# EAGLE design board-mostlaidout (EAGLE 9.5.2)
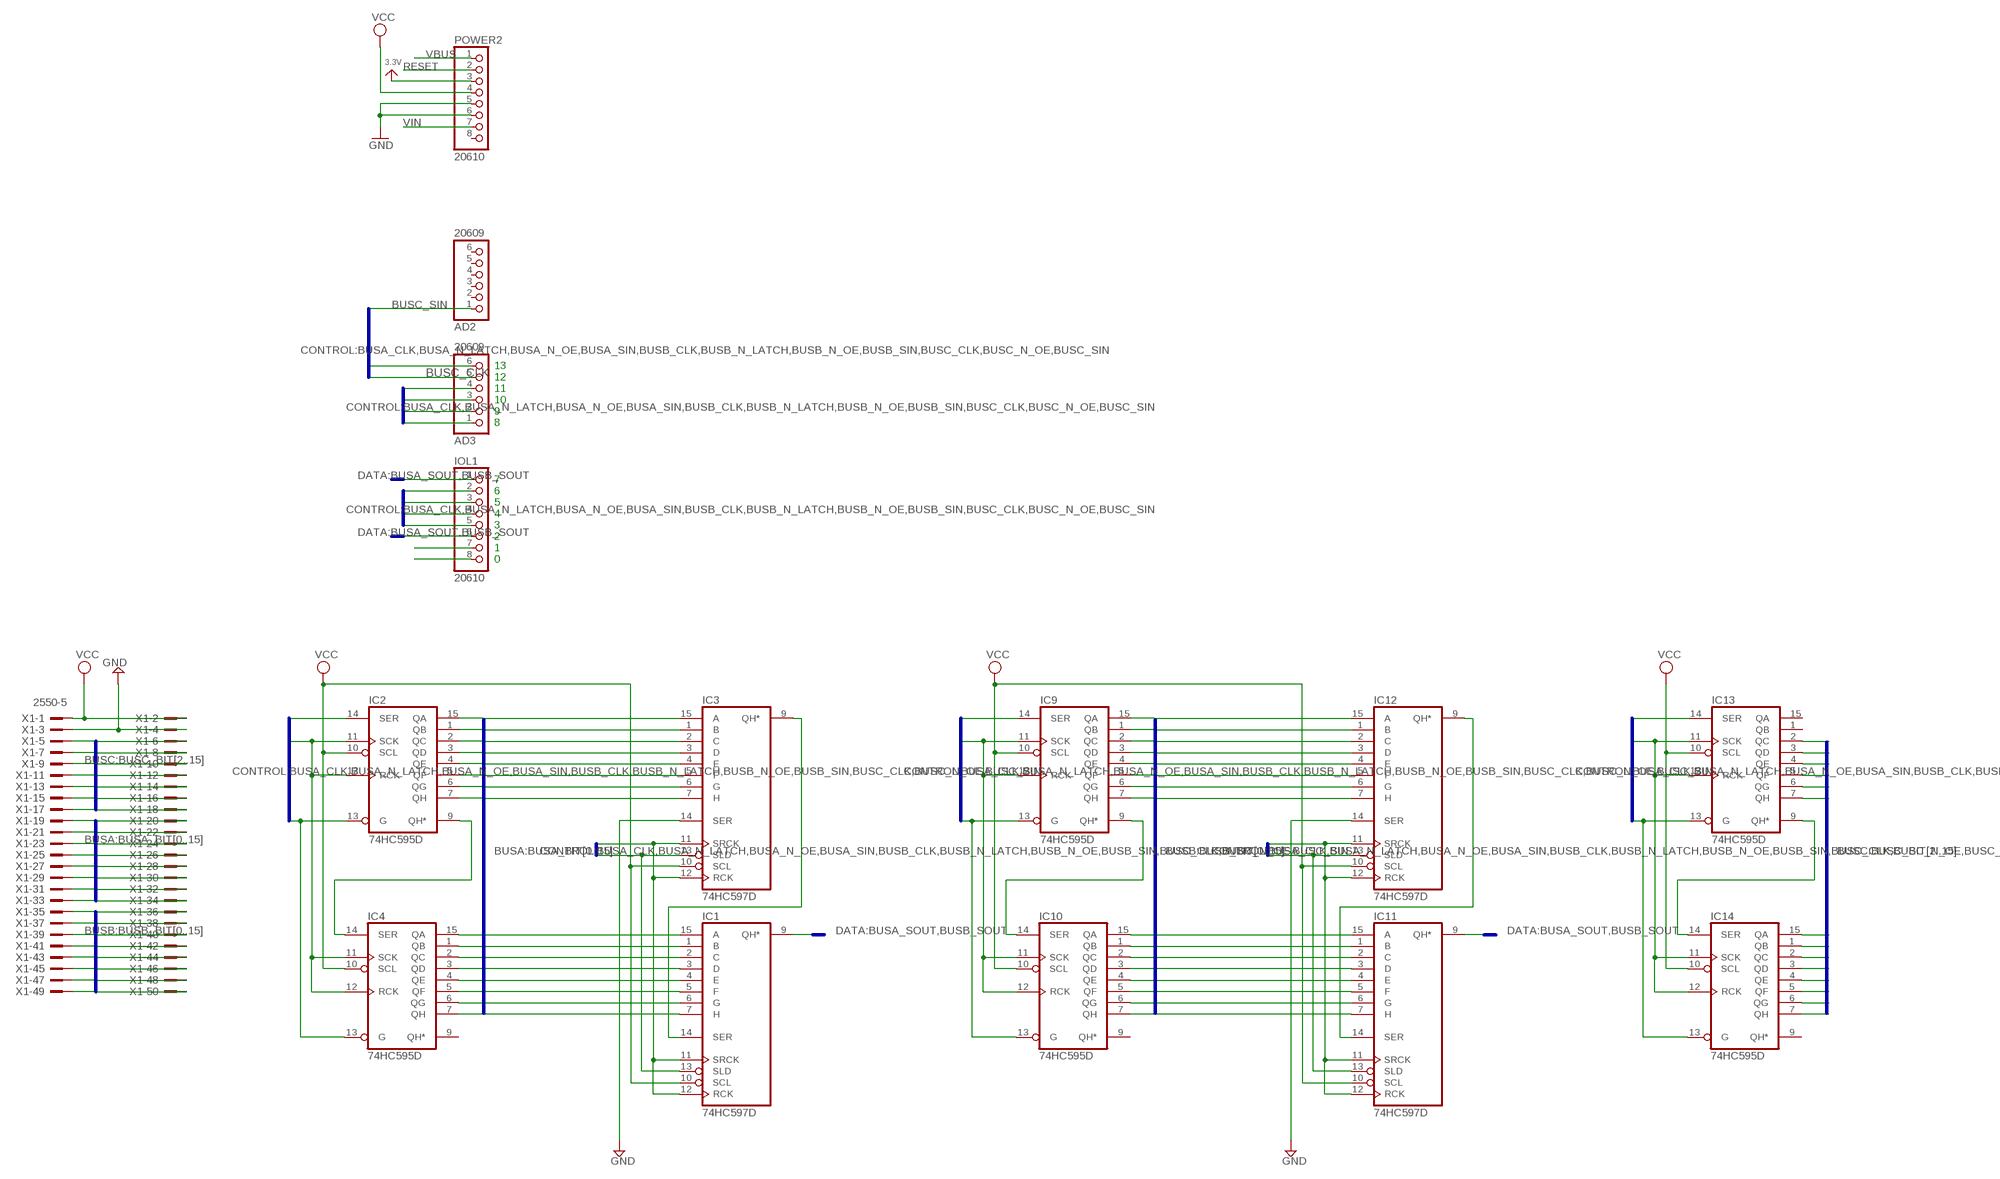
[diagram p0: schematic, sheet 1, part 1 of 2]
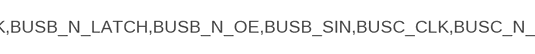
[diagram p1: schematic, sheet 1, part 2 of 2]

## Parts
AD2  20609  HEADER-1X6ROUND  [1X06_ROUND]
AD3  20609  HEADER-1X6ROUND  [1X06_ROUND]
IC1  74HC597D  [SO16]
IC2  74HC595D  [SO16]
IC3  74HC597D  [SO16]
IC4  74HC595D  [SO16]
IC9  74HC595D  [SO16]
IC10  74HC595D  [SO16]
IC11  74HC597D  [SO16]
IC12  74HC597D  [SO16]
IC13  74HC595D  [SO16]
IC14  74HC595D  [SO16]
IOL1  20610  HEADER-1X8ROUND  [1X08_ROUND]
POWER2  20610  HEADER-1X870MIL  [1X08_ROUND_70]
X1  2550-5  [PAK100/2500-5-50]

## Nets
3.3V: POWER2.3
BUSA_BIT0: IC2.15(QA) IC3.15(A) X1.19
BUSA_BIT1: IC2.1(QB) IC3.1(B) X1.20
BUSA_BIT2: IC2.2(QC) IC3.2(C) X1.21
BUSA_BIT3: IC2.3(QD) IC3.3(D) X1.22
BUSA_BIT4: IC2.4(QE) IC3.4(E) X1.23
BUSA_BIT5: IC2.5(QF) IC3.5(F) X1.24
BUSA_BIT6: IC2.6(QG) IC3.6(G) X1.25
BUSA_BIT7: IC2.7(QH) IC3.7(H) X1.26
BUSA_BIT8: IC1.15(A) IC4.15(QA) X1.27
BUSA_BIT9: IC1.1(B) IC4.1(QB) X1.28
BUSA_BIT10: IC1.2(C) IC4.2(QC) X1.29
BUSA_BIT11: IC1.3(D) IC4.3(QD) X1.30
BUSA_BIT12: IC1.4(E) IC4.4(QE) X1.31
BUSA_BIT13: IC1.5(F) IC4.5(QF) X1.32
BUSA_BIT14: IC1.6(G) IC4.6(QG) X1.33
BUSA_BIT15: IC1.7(H) IC4.7(QH) X1.34
BUSA_CLK: AD3.1 IC1.11(SRCK) IC1.12(RCK) IC2.11(SCK) IC2.12(RCK) IC3.11(SRCK) IC3.12(RCK) IC4.11(SCK) IC4.12(RCK)
BUSA_N_LATCH: AD3.2 IC1.13(SLD) IC3.13(SLD)
BUSA_N_OE: AD3.3 IC2.13(G) IC4.13(G)
BUSA_SIN: AD3.4 IC2.14(SER)
BUSA_SOUT: IC1.9(QH*) IOL1.1
BUSB_BIT0: IC9.15(QA) IC12.15(A) X1.35
BUSB_BIT1: IC9.1(QB) IC12.1(B) X1.36
BUSB_BIT2: IC9.2(QC) IC12.2(C) X1.37
BUSB_BIT3: IC9.3(QD) IC12.3(D) X1.38
BUSB_BIT4: IC9.4(QE) IC12.4(E) X1.39
BUSB_BIT5: IC9.5(QF) IC12.5(F) X1.40
BUSB_BIT6: IC9.6(QG) IC12.6(G) X1.41
BUSB_BIT7: IC9.7(QH) IC12.7(H) X1.42
BUSB_BIT8: IC10.15(QA) IC11.15(A) X1.43
BUSB_BIT9: IC10.1(QB) IC11.1(B) X1.44
BUSB_BIT10: IC10.2(QC) IC11.2(C) X1.45
BUSB_BIT11: IC10.3(QD) IC11.3(D) X1.46
BUSB_BIT12: IC10.4(QE) IC11.4(E) X1.47
BUSB_BIT13: IC10.5(QF) IC11.5(F) X1.48
BUSB_BIT14: IC10.6(QG) IC11.6(G) X1.49
BUSB_BIT15: IC10.7(QH) IC11.7(H) X1.50
BUSB_CLK: IC9.11(SCK) IC9.12(RCK) IC10.11(SCK) IC10.12(RCK) IC11.11(SRCK) IC11.12(RCK) IC12.11(SRCK) IC12.12(RCK) IOL1.5
BUSB_N_LATCH: IC11.13(SLD) IC12.13(SLD) IOL1.4
BUSB_N_OE: IC9.13(G) IC10.13(G) IOL1.3
BUSB_SIN: IC9.14(SER) IOL1.2
BUSB_SOUT: IC11.9(QH*) IOL1.6
BUSC_BIT2: IC13.2(QC) X1.5
BUSC_BIT3: IC13.3(QD) X1.6
BUSC_BIT4: IC13.4(QE) X1.7
BUSC_BIT5: IC13.5(QF) X1.8
BUSC_BIT6: IC13.6(QG) X1.9
BUSC_BIT7: IC13.7(QH) X1.10
BUSC_BIT8: IC14.15(QA) X1.11
BUSC_BIT9: IC14.1(QB) X1.12
BUSC_BIT10: IC14.2(QC) X1.13
BUSC_BIT11: IC14.3(QD) X1.14
BUSC_BIT12: IC14.4(QE) X1.15
BUSC_BIT13: IC14.5(QF) X1.16
BUSC_BIT14: IC14.6(QG) X1.17
BUSC_BIT15: IC14.7(QH) X1.18
BUSC_CLK: AD3.5 IC13.11(SCK) IC13.12(RCK) IC14.11(SCK) IC14.12(RCK)
BUSC_N_OE: AD3.6 IC13.13(G) IC14.13(G)
BUSC_SIN: AD2.1 IC13.14(SER)
GND: IC3.14(SER) IC12.14(SER) POWER2.5 POWER2.6 X1.3 X1.4
N$1: IC2.9(QH*) IC4.14(SER)
N$2: IC1.14(SER) IC3.9(QH*)
N$5: IC9.9(QH*) IC10.14(SER)
N$6: IC11.14(SER) IC12.9(QH*)
N$7: IC13.9(QH*) IC14.14(SER)
RESET: POWER2.2
RXD1: IOL1.8
TXD1: IOL1.7
VBUS: POWER2.1
VCC: IC1.10(SCL) IC2.10(SCL) IC3.10(SCL) IC4.10(SCL) IC9.10(SCL) IC10.10(SCL) IC11.10(SCL) IC12.10(SCL) IC13.10(SCL) IC14.10(SCL) POWER2.4 X1.1 X1.2
VIN [power]: POWER2.7
Unconnected: AD2.2 AD2.3 AD2.4 AD2.5 AD2.6 IC4.9(QH*) IC10.9(QH*) IC13.1(QB) IC13.15(QA) IC14.9(QH*) POWER2.8

## Buses
BUSA:BUSA_BIT[0..15]
CONTROL:BUSA_CLK,BUSA_N_LATCH,BUSA_N_OE,BUSA_SIN,BUSB_CLK,BUSB_N_LATCH,BUSB_N_OE,BUSB_SIN,BUSC_CLK,BUSC_N_OE,BUSC_SIN
BUSB:BUSB_BIT[0..15]
DATA:BUSA_SOUT,BUSB_SOUT
BUSC:BUSC_BIT[2..15]

## Notes on the sheet
- 13
- 12
- 11
- 10
- 9
- 8
- 7
- 6
- 5
- 4
- 3
- 2
- 1
- 0

## Power pins joined to a net without a drawn wire
GND: IC1.8(GND) IC2.8(GND) IC3.8(GND) IC4.8(GND) IC9.8(GND) IC10.8(GND) IC11.8(GND) IC12.8(GND) IC13.8(GND) IC14.8(GND)
VCC: IC1.16(VCC) IC2.16(VCC) IC3.16(VCC) IC4.16(VCC) IC9.16(VCC) IC10.16(VCC) IC11.16(VCC) IC12.16(VCC) IC13.16(VCC) IC14.16(VCC)

## Library data of the parts
AD2 AD3 = microbuilder:HEADER-1X6: PIN HEADER
IC1 IC3 IC11 IC12 = 74xx-eu:74*597: 8-bit SHIFT REGISTER, input latch
IC2 IC4 IC9 IC10 IC13 IC14 = 74xx-eu:74*595: 8-bit SHIFT REGISTER, output latch
IOL1 POWER2 = microbuilder:HEADER-1X8: PIN HEADER
X1 = con-3m:2550-: 3M (TM) Pak 100 4-Wall Header Source: 3M; OC_FARNELL: 1788696; OC_NEWARK: unknown

## Net classes
1 power: width 0.305 mm, drill 0.483 mm, clearance 0.203 mm
2 gnd: width 0.305 mm, drill 0.483 mm, clearance 0.203 mm
3 usbvcc: width 0.305 mm, drill 0.483 mm, clearance 0.203 mm

## Board
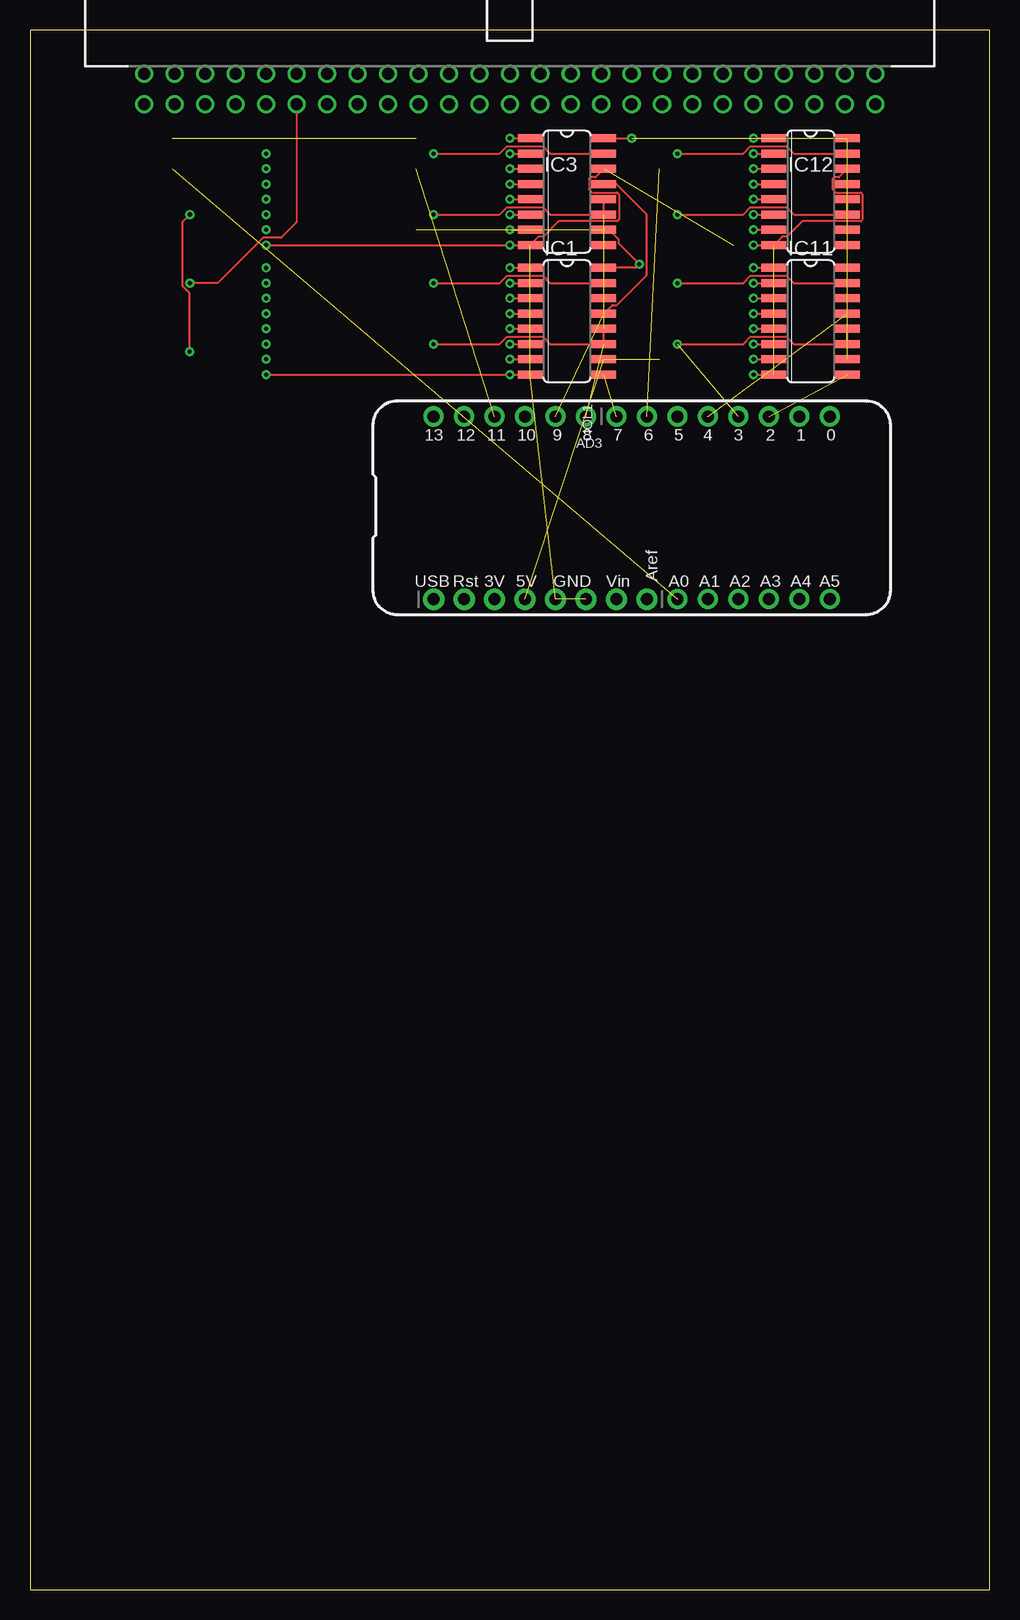
[diagram p2: board, top side]
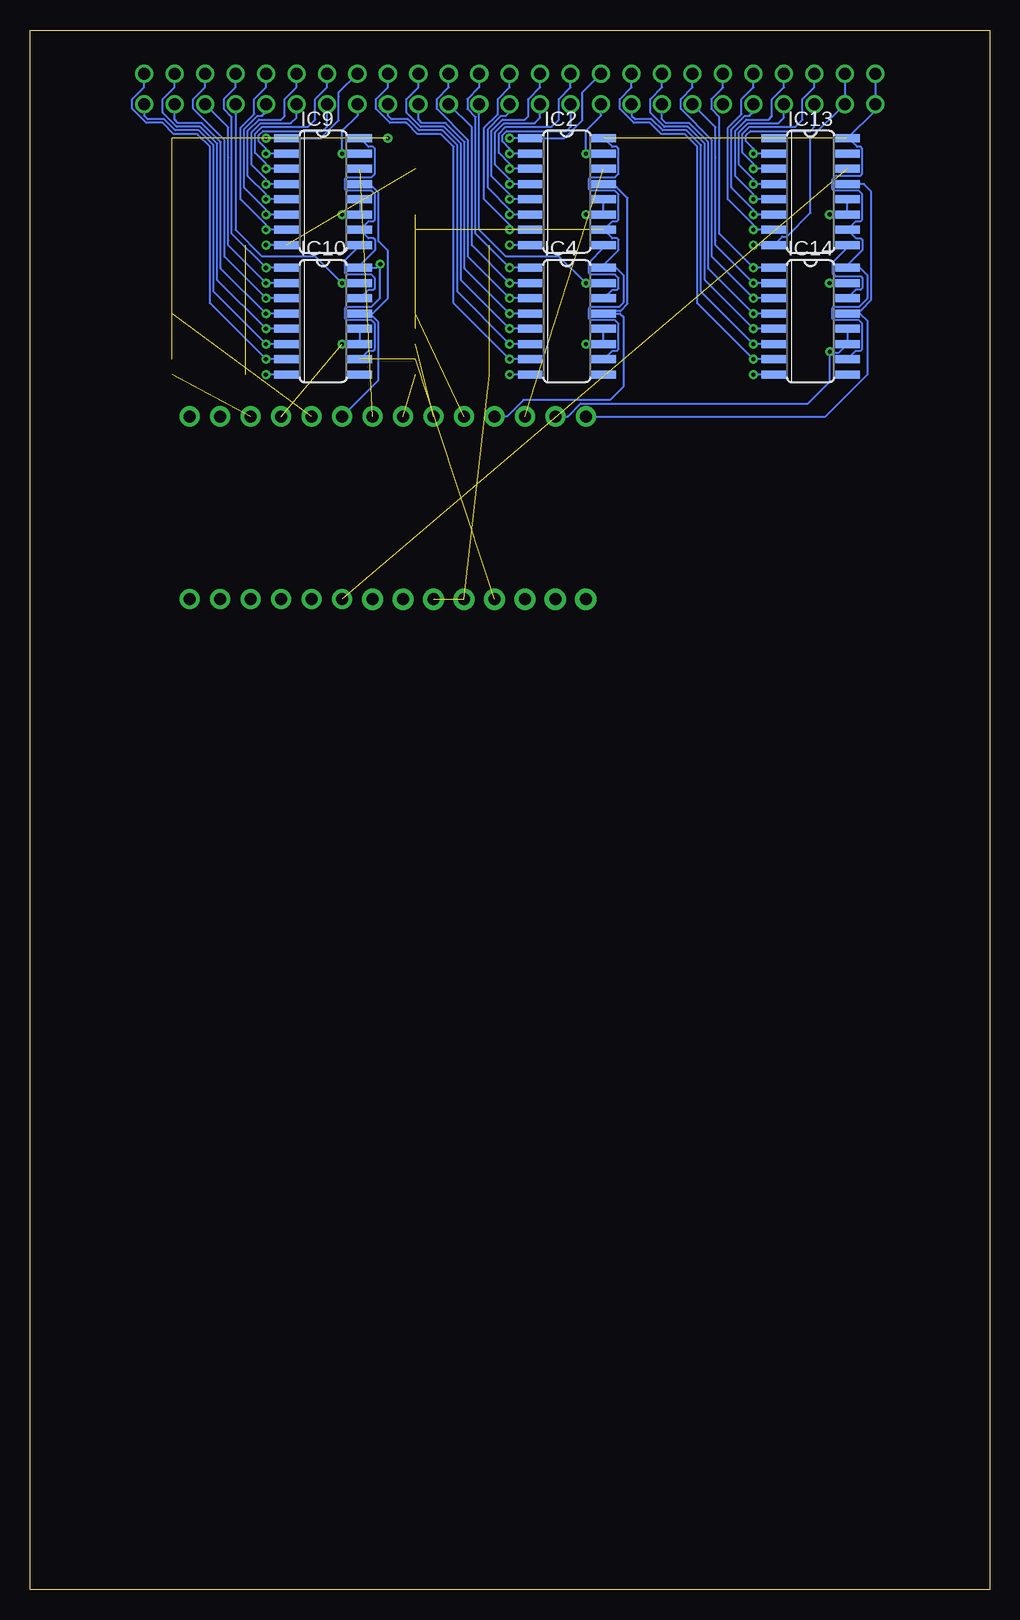
[diagram p3: board, bottom side, seen from below]

Size 80 x 130 mm. Coordinates in mm from the lower left corner, seen from the top.
Outline: 0,0 80,0 80,130 0,130 0,0
Copper layers (1*16): Top 0.035mm / dielectric 1.5mm / Bottom 0.035mm
Design rules "default": minimum track width 6mil, minimum drill 0.35mm, track to track 6mil, track to pad 6mil, pad to pad 6mil, via to via 6mil, smd to smd 6mil, copper to edge 40mil, drill to drill 6mil, minimum pad ring 10mil, minimum via ring 8mil, stop-mask expansion 4mil, vias tented up to drill 0mil, thermal gap 10mil

### Footprints (pad centres in the part's own frame; a part is rotated, then mirrored left to right if it is on the bottom)
1X06_ROUND = drill 1 pad 1.676: 1 -6.35,0; 2 -3.81,0; 3 -1.27,0; 4 1.27,0; 5 3.81,0; 6 6.35,0
SO16 = smd 0.66 x 2.032: 1 -4.445,-3.073; 2 -3.175,-3.073; 3 -1.905,-3.073; 4 -0.635,-3.073; 5 0.635,-3.073; 6 1.905,-3.073; 7 3.175,-3.073; 8 4.445,-3.073; 9 4.445,3.073; 10 3.175,3.073; 11 1.905,3.073; 12 0.635,3.073; 13 -0.635,3.073; 14 -1.905,3.073; 15 -3.175,3.073; 16 -4.445,3.073
1X08_ROUND = drill 1 pad 1.676: 1 -8.89,0; 2 -6.35,0; 3 -3.81,0; 4 -1.27,0; 5 1.27,0; 6 3.81,0; 7 6.35,0; 8 8.89,0
1X08_ROUND_70 = drill 1 pad 1.778: 1 -8.89,0; 2 -6.35,0; 3 -3.81,0; 4 -1.27,0; 5 1.27,0; 6 3.81,0; 7 6.35,0; 8 8.89,0
PAK100/2500-5-50 = drill 1 pad 1.422: 1 -30.48,-1.27; 2 -30.48,1.27; 3 -27.94,-1.27; 4 -27.94,1.27; 5 -25.4,-1.27; 6 -25.4,1.27; 7 -22.86,-1.27; 8 -22.86,1.27; 9 -20.32,-1.27; 10 -20.32,1.27; 11 -17.78,-1.27; 12 -17.78,1.27; 13 -15.24,-1.27; 14 -15.24,1.27; 15 -12.7,-1.27; 16 -12.7,1.27; 17 -10.16,-1.27; 18 -10.16,1.27; 19 -7.62,-1.27; 20 -7.62,1.27; 21 -5.08,-1.27; 22 -5.08,1.27; 23 -2.54,-1.27; 24 -2.54,1.27; 25 0,-1.27; 26 0,1.27; 27 2.54,-1.27; 28 2.54,1.27; 29 5.08,-1.27; 30 5.08,1.27; 31 7.62,-1.27; 32 7.62,1.27; 33 10.16,-1.27; 34 10.16,1.27; 35 12.7,-1.27; 36 12.7,1.27; 37 15.24,-1.27; 38 15.24,1.27; 39 17.78,-1.27; 40 17.78,1.27; 41 20.32,-1.27; 42 20.32,1.27; 43 22.86,-1.27; 44 22.86,1.27; 45 25.4,-1.27; 46 25.4,1.27; 47 27.94,-1.27; 48 27.94,1.27; 49 30.48,-1.27; 50 30.48,1.27

### Placement (x,y rotation side)
AD2  60.33,82.55 0 top
AD3  40.01,97.79 180 top
IC1  44.77,105.73 270 top
IC2  35.24,116.52 270 bottom
IC3  44.77,116.52 270 top
IC4  35.24,105.73 270 bottom
IC9  55.56,116.52 270 bottom
IC10  55.56,105.73 270 bottom
IC11  65.09,105.73 270 top
IC12  65.09,116.52 270 top
IC13  14.92,116.52 270 bottom
IC14  14.92,105.73 270 bottom
IOL1  57.78,97.79 0 top
POWER2  42.55,82.55 0 top
X1  40.01,125.09 0 top

### Tracks (layer width: path | path; a pad name or v marks a point on that pad's centre or on a via)
BUSA_BIT0  (via drill 0.35)  (1 unrouted)
  Top 0.152: v33.66,119.7 39.15,119.7 39.75,120.3 42.76,120.3 43.36,119.7 IC3.15
  Bottom 0.152: IC2.15 v33.66,119.7 33.66,121.6 32.38,122.87 X1.19
BUSA_BIT1  (via drill 0.35)
  Top 0.152: v40.01,120.97 IC3.1
  Bottom 0.152: v40.01,120.97 IC2.1 35.45,120.97 33.94,122.47 33.94,124.81 X1.20
BUSA_BIT2  (via drill 0.35)
  Top 0.152: v40.01,119.7 IC3.2
  Bottom 0.152: IC2.2 v40.01,119.7 40.01,120.11 40.61,120.72 40.61,121.22 40.26,121.57 35.27,121.57 34.92,121.92 X1.21
BUSA_BIT3  (via drill 0.35)
  Top 0.152: v40.01,118.43 IC3.3
  Bottom 0.152: IC2.3 v40.01,118.43 40.01,118.84 40.92,119.75 40.92,121.34 40.34,121.92 36.51,121.92 35.91,122.53 35.91,124.23 34.92,125.22 X1.22
BUSA_BIT4  (via drill 0.35)
  Top 0.152: v40.01,117.16 IC3.4
  Bottom 0.152: IC2.4 v40.01,117.16 40.01,117.57 41.22,118.79 41.22,121.47 40.47,122.22 37.94,122.22 37.47,122.69 X1.23
BUSA_BIT5  (via drill 0.35)
  Top 0.152: v40.01,115.89 IC3.5
  Bottom 0.152: IC2.5 v40.01,115.89 40.01,116.3 41.53,117.82 41.53,121.6 40.59,122.53 38.73,122.53 38.45,122.82 38.45,124.23 37.47,125.22 X1.24
BUSA_BIT6  (via drill 0.35)
  Top 0.152: v40.01,114.62 IC3.6
  Bottom 0.152: IC2.6 v40.01,114.62 40.01,115.03 41.83,116.86 41.83,121.72 40.72,122.83 40.32,122.83 40.01,123.15 X1.25
BUSA_BIT7  (via drill 0.35)
  Top 0.152: v40.01,113.35 IC3.7
  Bottom 0.152: IC2.7 v40.01,113.35 40.01,113.76 42.14,115.89 42.14,121.85 40.99,123 40.99,124.23 40.01,125.22 X1.26
BUSA_BIT8  (via drill 0.35)  (1 unrouted)
  Top 0.152: v33.66,108.9 39.15,108.9 39.75,109.51 42.76,109.51 43.36,108.9 IC1.15
  Bottom 0.152: IC4.15 v33.66,108.9 35.88,111.12 40.32,111.12 42.55,113.35 X1.27
BUSA_BIT9  (via drill 0.35)
  Top 0.152: v40.01,110.17 IC1.1
  Bottom 0.152: IC4.1 v40.01,110.17 42.85,113.02 42.85,122.74 43.53,123.42 43.53,124.23 42.55,125.22 X1.28
BUSA_BIT10  (via drill 0.35)
  Top 0.152: v40.01,108.9 IC1.2
  Bottom 0.152: IC4.2 v40.01,108.9 43.16,112.05 43.16,112.46 43.16,119.38 43.16,121.89 X1.29
BUSA_BIT11  (via drill 0.35)
  Top 0.152: v40.01,107.63 IC1.3
  Bottom 0.152: IC4.3 v40.01,107.63 43.46,111.09 43.46,120.81 46.07,123.42 46.07,124.23 45.09,125.22 X1.30
BUSA_BIT12  (via drill 0.35)
  Top 0.152: v40.01,106.36 IC1.4
  Bottom 0.152: IC4.4 v40.01,106.36 43.76,110.12 43.76,120.65 45.35,122.24 47.31,122.24 47.62,122.56 X1.31
BUSA_BIT13  (via drill 0.35)
  Top 0.152: v40.01,105.09 IC1.5
  Bottom 0.152: IC4.5 v40.01,105.09 44.07,109.16 44.07,120.52 45.48,121.93 47.43,121.93 48.61,123.11 48.61,124.23 47.62,125.22 X1.32
BUSA_BIT14  (via drill 0.35)
  Top 0.152: v40.01,103.82 IC1.6
  Bottom 0.152: IC4.6 v40.01,103.82 44.37,108.19 44.37,120.4 45.6,121.63 47.56,121.63 48.49,122.56 49.85,122.56 50.16,122.87 X1.33
BUSA_BIT15  (via drill 0.35)
  Top 0.152: v40.01,102.55 IC1.7
  Bottom 0.152: IC4.7 v40.01,102.55 44.68,107.23 44.68,120.27 45.73,121.32 47.69,121.32 48.61,122.25 49.98,122.25 51.15,123.42 51.15,124.23 50.16,125.22 X1.34
BUSA_CLK  (via drill 0.35)  (2 unrouted)
  Top 0.152: v33.66,114.62 39.15,114.62 39.75,115.22 42.76,115.22 43.36,114.62 IC3.11 IC3.12 | IC1.12 IC1.11 43.36,103.82 42.76,104.43 39.75,104.43 39.15,103.82 v33.66,103.82
  Bottom 0.152: v33.66,114.62 IC2.11 IC2.12 | IC4.12 IC4.11 v33.66,103.82
BUSA_N_LATCH  (1 unrouted)
  Top 0.152: IC1.13 48.55,107.07 48.95,107.07 51.44,109.56 51.44,114.62 48.9,117.16 IC3.13
BUSA_N_OE
  Bottom 0.152: AD3.3 40.24,97.79 38.87,99.16 31.65,99.16 30.48,100.33 30.48,106.05 30.8,106.36 IC4.13 | IC4.13 31.43,106.36 | IC4.13 31.91,106.62 30.75,106.62 30.18,107.19 30.18,115.99 31.09,116.9 31.91,116.9 IC2.13
BUSA_SIN  (1 unrouted)
BUSA_SOUT  (1 unrouted)
BUSB_BIT0  (via drill 0.35)  (1 unrouted)
  Top 0.152: v53.98,119.7 59.47,119.7 60.07,120.3 63.08,120.3 63.68,119.7 IC12.15
  Bottom 0.152: IC9.15 v53.98,119.7 53.98,121.6 52.7,122.87 X1.35
BUSB_BIT1  (via drill 0.35)
  Top 0.152: v60.33,120.97 IC12.1
  Bottom 0.152: v60.33,120.97 IC9.1 55.77,120.97 54.26,122.47 54.26,124.46 54.26,124.81 X1.36
BUSB_BIT2  (via drill 0.35)
  Top 0.152: v60.33,119.7 IC12.2
  Bottom 0.152: IC9.2 v60.33,119.7 60.33,120.11 60.93,120.72 60.93,121.22 60.58,121.57 55.59,121.57 55.24,121.92 X1.37
BUSB_BIT3  (via drill 0.35)
  Top 0.152: v60.33,118.43 IC12.3
  Bottom 0.152: IC9.3 v60.33,118.43 60.33,118.84 61.24,119.75 61.24,121.34 60.66,121.92 56.83,121.92 56.23,122.53 56.23,124.23 55.24,125.22 X1.38
BUSB_BIT4  (via drill 0.35)
  Top 0.152: v60.33,117.16 IC12.4
  Bottom 0.152: IC9.4 v60.33,117.16 60.33,117.57 61.54,118.79 61.54,121.47 60.79,122.22 58.26,122.22 57.78,122.69 X1.39
BUSB_BIT5  (via drill 0.35)
  Top 0.152: v60.33,115.89 IC12.5
  Bottom 0.152: IC9.5 v60.33,115.89 60.33,116.3 61.85,117.82 61.85,121.6 60.91,122.53 59.05,122.53 58.77,122.82 58.77,124.23 57.78,125.22 X1.40
BUSB_BIT6  (via drill 0.35)
  Top 0.152: v60.33,114.62 IC12.6
  Bottom 0.152: IC9.6 v60.33,114.62 60.33,115.03 62.15,116.86 62.15,121.72 61.04,122.83 60.64,122.83 60.33,123.15 X1.41
BUSB_BIT7  (via drill 0.35)
  Top 0.152: v60.33,113.35 IC12.7
  Bottom 0.152: IC9.7 v60.33,113.35 60.33,113.76 62.46,115.89 62.46,121.85 61.31,123 61.31,124.23 60.33,125.22 X1.42
BUSB_BIT8  (via drill 0.35)  (1 unrouted)
  Top 0.152: v53.98,108.9 59.47,108.9 60.07,109.51 63.08,109.51 63.68,108.9 IC11.15
  Bottom 0.152: IC10.15 v53.98,108.9 56.2,111.12 60.64,111.12 62.87,113.35 X1.43
BUSB_BIT9  (via drill 0.35)
  Top 0.152: v60.33,110.17 IC11.1
  Bottom 0.152: IC10.1 v60.33,110.17 63.17,113.02 63.17,122.74 63.85,123.42 63.85,124.23 62.92,125.16 62.87,125.22 X1.44
BUSB_BIT10  (via drill 0.35)
  Top 0.152: v60.33,108.9 IC11.2
  Bottom 0.152: IC10.2 v60.33,108.9 63.48,112.05 63.48,112.46 63.48,119.38 63.48,121.89 X1.45
BUSB_BIT11  (via drill 0.35)
  Top 0.152: v60.33,107.63 IC11.3
  Bottom 0.152: IC10.3 v60.33,107.63 63.78,111.09 63.78,120.81 66.39,123.42 66.39,124.23 65.41,125.22 X1.46
BUSB_BIT12  (via drill 0.35)
  Top 0.152: v60.33,106.36 IC11.4
  Bottom 0.152: IC10.4 v60.33,106.36 64.08,110.12 64.08,120.65 65.67,122.24 67.63,122.24 67.94,122.56 X1.47
BUSB_BIT13  (via drill 0.35)
  Top 0.152: v60.33,105.09 IC11.5
  Bottom 0.152: IC10.5 v60.33,105.09 64.39,109.16 64.39,120.52 65.8,121.93 67.75,121.93 68.93,123.11 68.93,124.23 67.94,125.22 X1.48
BUSB_BIT14  (via drill 0.35)
  Top 0.152: v60.33,103.82 IC11.6
  Bottom 0.152: IC10.6 v60.33,103.82 64.69,108.19 64.69,120.4 65.92,121.63 67.88,121.63 68.81,122.56 70.17,122.56 70.48,122.87 70.48,123.19 X1.49
BUSB_BIT15  (via drill 0.35)
  Top 0.152: v60.33,102.55 IC11.7
  Bottom 0.152: IC10.7 v60.33,102.55 65,107.23 65,120.27 66.05,121.32 68.01,121.32 68.93,122.25 70.3,122.25 71.47,123.42 71.47,124.23 70.55,125.16 70.48,125.22 X1.50
BUSB_CLK  (via drill 0.35)  (2 unrouted)
  Top 0.152: v53.98,114.62 59.47,114.62 60.07,115.22 63.08,115.22 63.68,114.62 IC12.11 IC12.12 | IC11.12 IC11.11 63.68,103.82 63.08,104.43 60.07,104.43 59.47,103.82 v53.98,103.82
  Bottom 0.152: v53.98,114.62 IC9.11 IC9.12 | IC10.12 IC10.11 v53.98,103.82
BUSB_N_LATCH  (2 unrouted)
BUSB_N_OE
  Bottom 0.152: 52.44,106.31 52.23,106.11 51.41,106.11 50.94,105.64 50.94,100.83 IOL1.3 | 52.44,106.31 IC10.13 51.44,106.36 50.16,107.63 50.16,111.62 50.94,112.39 50.94,116.44 51.41,116.9 52.23,116.9 IC9.13 | 52.44,106.31 52.13,106.62 51.84,106.62
BUSB_SIN  (1 unrouted)
BUSB_SOUT  (1 unrouted)
BUSC_BIT2  (via drill 0.35)
  Bottom 0.152: IC13.2 v19.68,119.7 19.68,120.11 20.29,120.72 20.29,121.22 19.94,121.57 14.95,121.57 14.61,121.92 X1.5
BUSC_BIT3  (via drill 0.35)
  Bottom 0.152: IC13.3 v19.68,118.43 19.68,118.84 20.6,119.75 20.6,121.34 20.02,121.92 16.19,121.92 15.59,122.53 15.59,124.23 14.61,125.22 X1.6
BUSC_BIT4  (via drill 0.35)
  Bottom 0.152: IC13.4 v19.68,117.16 19.68,117.57 20.9,118.79 20.9,121.47 20.15,122.22 17.61,122.22 17.14,122.69 X1.7
BUSC_BIT5  (via drill 0.35)
  Bottom 0.152: IC13.5 v19.68,115.89 19.68,116.3 21.21,117.82 21.21,121.6 20.27,122.53 18.41,122.53 18.13,122.82 18.13,124.23 17.14,125.22 X1.8
BUSC_BIT6  (via drill 0.35)
  Bottom 0.152: IC13.6 v19.68,114.62 19.68,115.03 21.51,116.86 21.51,121.72 20.4,122.83 20,122.83 19.68,123.15 X1.9
BUSC_BIT7  (via drill 0.35)
  Bottom 0.152: IC13.7 v19.68,113.35 19.68,113.76 21.82,115.89 21.82,121.85 20.67,123 20.67,124.23 19.68,125.22 X1.10
BUSC_BIT8  (via drill 0.35)
  Top 0.152: X1.11 22.23,113.98 20.93,112.68 19.43,112.68 15.65,108.9 v13.34,108.9
  Bottom 0.152: v13.34,108.9 IC14.15
BUSC_BIT9  (via drill 0.35)
  Bottom 0.152: IC14.1 v19.68,110.17 22.53,113.02 22.53,122.74 23.21,123.42 23.21,124.23 22.29,125.16 22.23,125.22 X1.12
BUSC_BIT10  (via drill 0.35)
  Bottom 0.152: IC14.2 v19.68,108.9 22.84,112.05 22.84,112.46 22.84,119.38 22.84,121.89 X1.13
BUSC_BIT11  (via drill 0.35)
  Bottom 0.152: IC14.3 v19.68,107.63 23.14,111.09 23.14,120.81 25.75,123.42 25.75,124.23 24.77,125.22 X1.14
BUSC_BIT12  (via drill 0.35)
  Bottom 0.152: IC14.4 v19.68,106.36 23.44,110.12 23.44,120.65 25.03,122.24 26.99,122.24 27.3,122.56 X1.15
BUSC_BIT13  (via drill 0.35)
  Bottom 0.152: IC14.5 v19.68,105.09 23.75,109.16 23.75,120.52 25.16,121.93 27.11,121.93 28.29,123.11 28.29,124.23 27.3,125.22 X1.16
BUSC_BIT14  (via drill 0.35)
  Bottom 0.152: IC14.6 v19.68,103.82 24.05,108.19 24.05,120.4 25.28,121.63 27.24,121.63 28.17,122.56 29.53,122.56 29.84,122.87 X1.17
BUSC_BIT15  (via drill 0.35)
  Bottom 0.152: IC14.7 v19.68,102.55 24.36,107.23 24.36,120.27 25.41,121.32 27.37,121.32 28.29,122.25 29.66,122.25 30.83,123.42 30.83,124.23 29.84,125.22 X1.18
BUSC_CLK  (via drill 0.35)
  Top 0.152: v13.31,103.19 13.31,108.07 12.73,108.65 12.73,114.01 v13.34,114.62
  Bottom 0.152: IC13.12 IC13.11 v13.34,114.62 | IC14.12 IC14.11 12.56,103.11 13.23,103.11 v13.31,103.19 13.31,100.67 15.13,98.86 34.1,98.86 35.16,97.79 AD3.5
BUSC_N_OE
  Bottom 0.152: AD3.6 13.67,97.79 10.16,101.3 10.16,105.73 10.79,106.36 IC14.13 11.6,106.62 10.74,106.62 9.86,107.51 9.86,116.53 10.48,117.16 IC13.13
BUSC_SIN  (1 unrouted)
GND  (via drill 0.35)  (5 unrouted)
  Top 0.152: IC1.8 v40.01,101.28 v19.68,101.28 | v60.33,112.08 IC12.8 62.73,112.79 63.12,112.79 64.39,114.06 69.27,114.06 69.41,114.19 69.41,116.31 69.27,116.45 67.2,116.45 66.92,116.73 66.92,117.58 67.05,117.72 67.45,117.72 IC12.14 | v60.33,101.28 IC11.8 | IC3.14 47.13,117.72 46.73,117.72 46.6,117.58 46.6,116.73 46.88,116.45 48.95,116.45 49.09,116.31 49.09,114.19 48.95,114.06 44.08,114.06 42.8,112.79 42.41,112.79 IC3.8 v40.01,112.08 v19.68,112.08
  Bottom 0.152: X1.4 X1.3 14.92,120.97 14.92,114.75 16.89,112.79 17.29,112.79 IC13.8 v19.68,112.08 | IC2.8 v40.01,112.08 | IC4.8 v40.01,101.28 | IC9.8 v60.33,112.08 | IC10.8 v60.33,101.28 | IC14.8 v19.68,101.28
N$1
  Bottom 0.152: IC4.14 31.46,108.34 31.06,108.34 30.92,108.48 30.92,109.33 31.21,109.61 33.28,109.61 33.41,109.75 33.41,110.6 32.17,111.84 IC2.9
N$2  (1 unrouted)
N$5
  Bottom 0.152: IC10.14 51.78,108.34 51.38,108.34 51.24,108.48 51.24,109.33 51.53,109.61 53.6,109.61 53.73,109.75 53.73,110.83 IC9.9
N$6  (1 unrouted)
N$7
  Bottom 0.152: IC13.9 11.85,111.84 13.09,110.6 13.09,109.75 12.81,109.46 10.74,109.46 10.6,109.33 10.6,108.48 10.74,108.34 11.14,108.34 IC14.14
VCC  (via drill 0.35)  (9 unrouted)
  Top 0.152: IC3.16 v50.16,120.97 | IC3.10 48.24,113.35 49.09,112.5 49.09,112.2 v50.8,110.49 50.48,110.17 IC1.16
  Bottom 0.152: X1.2 X1.1 9.53,123.29 11.8,121.02 | IC13.16 11.8,121.02 | IC14.10 11.14,103.26 10.74,103.26 10.6,103.4 10.6,105.52 10.89,105.8 12.96,105.8 13.09,105.94 13.09,106.79 12.96,106.92 10.87,106.92 10.16,107.63 10.16,109.54 10.79,110.17 IC14.16 11.85,110.41 10.6,111.65 10.6,112.5 10.74,112.64 11.14,112.64 IC13.10 11.14,114.06 10.74,114.06 10.6,114.19 10.6,116.31 10.89,116.6 12.96,116.6 13.09,116.73 13.09,117.58 12.81,117.87 10.74,117.87 10.6,118 10.6,120.12 10.74,120.26 11.04,120.26 11.8,121.02 | IC4.10 31.46,103.26 31.06,103.26 30.92,103.4 30.92,105.52 31.21,105.8 33.28,105.8 33.41,105.94 33.41,106.79 33.28,106.92 30.87,106.92 30.48,107.31 30.48,109.54 31.35,110.41 32.17,110.41 | IC4.16 32.17,110.41 | 32.17,110.41 30.92,111.65 30.92,112.5 31.06,112.64 31.46,112.64 IC2.10 31.46,114.06 31.06,114.06 30.92,114.19 30.92,116.31 31.21,116.6 33.28,116.6 33.41,116.73 33.41,117.58 33.28,117.72 31.21,117.72 30.92,118 30.92,120.12 31.06,120.26 31.46,120.26 IC2.16 | IC10.10 51.78,103.26 51.38,103.26 51.24,103.4 51.24,105.52 51.53,105.8 53.6,105.8 53.73,105.94 53.73,106.79 53.6,106.92 51.53,106.92 50.8,107.65 v50.8,110.49 51.12,110.17 IC10.16 52.49,110.41 51.24,111.65 51.24,112.5 51.38,112.64 51.78,112.64 IC9.10 51.78,114.06 51.38,114.06 51.24,114.19 51.24,116.31 51.53,116.6 53.6,116.6 53.73,116.73 53.73,117.58 53.6,117.72 51.53,117.72 51.24,118 51.24,120.12 51.38,120.26 51.78,120.26 IC9.16

### Text on the board
tPlace: 13 | 12 | 11 | 10 | 9 | 8 | 7 | 6 | 5 | 4 | 3 | 2 | 1 | 0 | Aref | USB | Rst | 3V | 5V | GND | Vin | A0 | A1 | A2 | A3 | A4 | A5
214bmp: D:/SmartProjects/Snc/a4_bn_logo2.bmp